# Altium project shield.PrjPcb
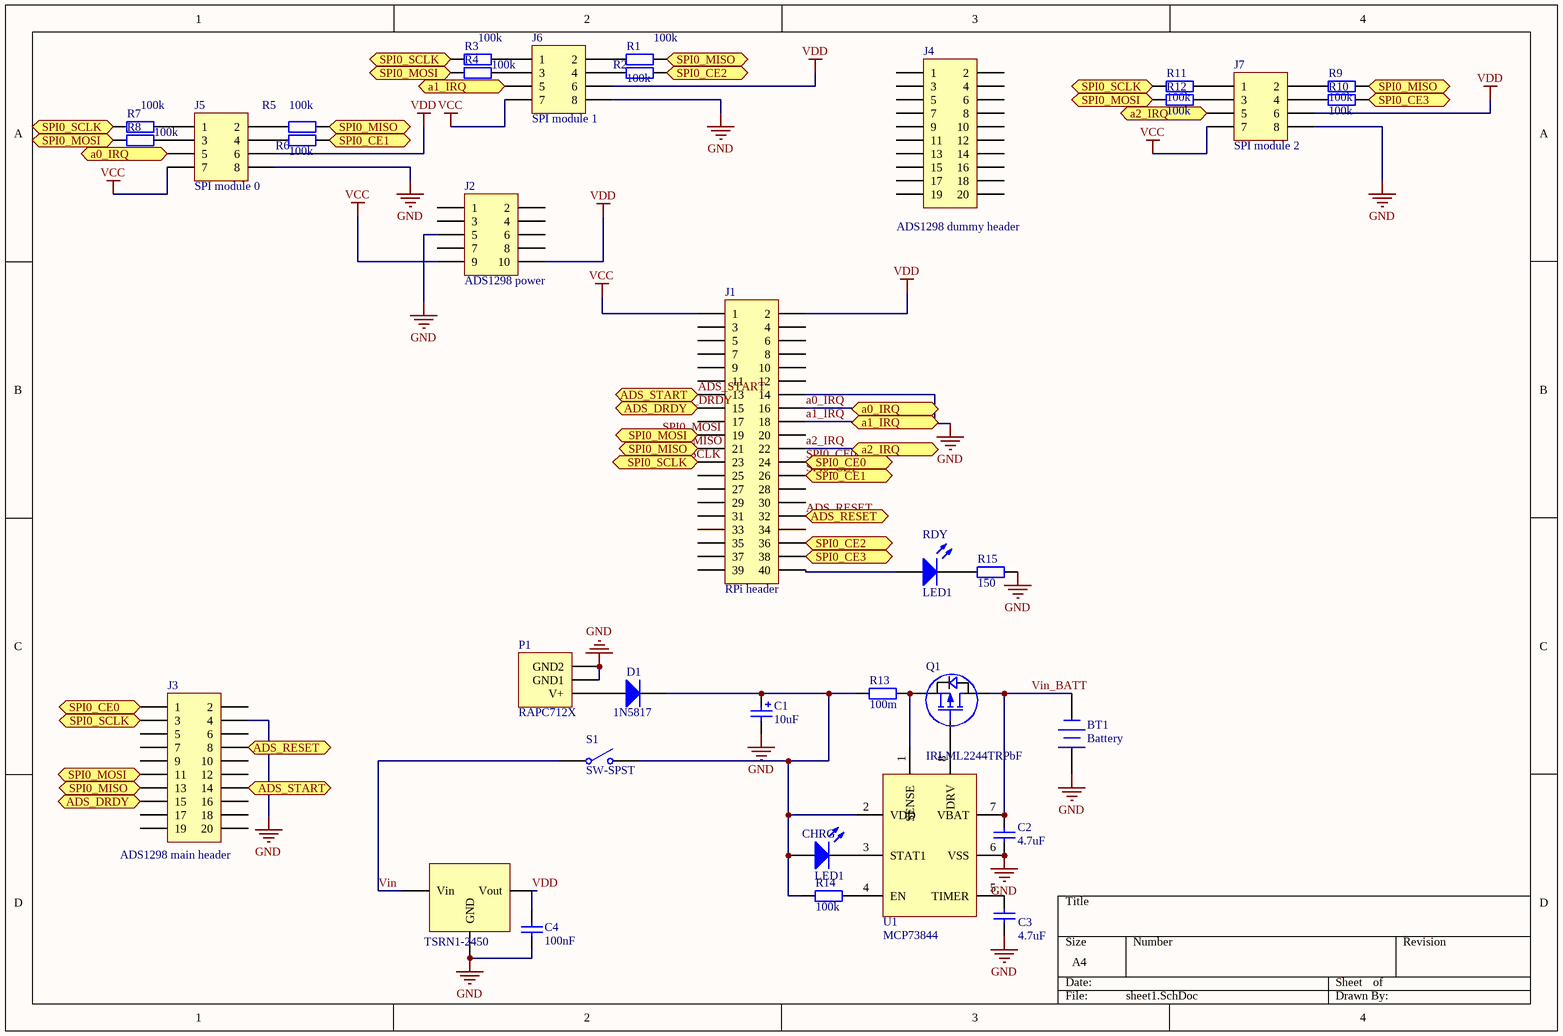
[diagram p0: sheet1.SchDoc]
1 sheet, 35 parts. Net scope: global (net labels, ports and power ports of the same name join across sheets).
Board file: shield.PcbDoc

## Sheet sheet1.SchDoc
size A4; SheetNumber: 1

### Parts
BT1  Battery  [HDR1X2H]
C1  value 10uF  [CAPR5-4X5]  (hidden comment: Comment)
C2  value 4.7uF  [CAPR5-4X5]  (hidden comment: Comment)
C3  value 4.7uF  [CAPR5-4X5]  (hidden comment: Comment)
C4  value 100nF  [CAPR5-4X5]  (hidden comment: Comment)
CHRG  LED1  [LED-1]
D1  1N5817  [DO-41]
J1  RPi header  [HDR2X20]
J2  ADS1298 power  [HDR2X5]
J3  ADS1298 main header  [HDR2X10]
J4  ADS1298 dummy header  [HDR2X10]
J5  SPI module 0  [HDR1X8H]
J6  SPI module 1  [HDR1X8H]
J7  SPI module 2  [HDR1X8H]
P1  RAPC712X  [DCjack]
Q1  IRLML2244TRPbF  [SOT-23_L]
R1  value 100k  [AXIAL-0.6]  (hidden comment: Comment)
R2  value 100k  [AXIAL-0.6]  (hidden comment: Comment)
R3  value 100k  [AXIAL-0.6]  (hidden comment: Comment)
R4  value 100k  [AXIAL-0.6]  (hidden comment: Comment)
R5  value 100k  [AXIAL-0.6]  (hidden comment: Comment)
R6  value 100k  [AXIAL-0.6]  (hidden comment: Comment)
R7  value 100k  [AXIAL-0.6]  (hidden comment: Comment)
R8  value 100k  [AXIAL-0.6]  (hidden comment: Comment)
R9  value 100k  [AXIAL-0.6]  (hidden comment: Comment)
R10  value 100k  [AXIAL-0.6]  (hidden comment: Comment)
R11  value 100k  [AXIAL-0.6]  (hidden comment: Comment)
R12  value 100k  [AXIAL-0.6]  (hidden comment: Comment)
R13  value 100m  [AXIAL-1.0]  (hidden comment: Comment)
R14  value 100k  [AXIAL-0.6]  (hidden comment: Comment)
R15  value 150  [AXIAL-0.6]  (hidden comment: Comment)
RDY  LED1  [LED-1]
RG1  TSRN1-2450  [TSRN1-2450]
S1  SW-SPST  [HDR1X2H]
U1  MCP73844  [MSOP-8]

### Ports
a0_IRQ, a1_IRQ, a2_IRQ, ADS_DRDY, ADS_RESET, ADS_START, SPI0_CE0, SPI0_CE1, SPI0_CE2, SPI0_CE3, SPI0_MISO, SPI0_MISO (in), SPI0_MOSI, SPI0_SCLK

### Nets
GND: BT1.1(+) C1.2 C2.2 C3.2 C4.2 J1.14 J2.5 J3.4 J5.8 J6.8 J7.8 P1.GND1 P1.GND2 R15.1 RG1.2(GND) U1.6(VSS)
VCC: J1.1 J2.9 J5.7 J6.7 J7.7
VDD: C4.1 J1.2 J2.10 J5.6 J6.6 J7.6 RG1.3(Vout)
a0_IRQ: J1.16 J5.5 ; port a0_IRQ
a1_IRQ: J1.18 J6.5 ; port a1_IRQ
a2_IRQ: J1.22 J7.5 ; port a2_IRQ
ADS_RESET: J1.32 J3.8 ; port ADS_RESET
ADS_START: J1.13 J3.14 ; port ADS_START
SPI0_CE0: J1.24 J3.1 ; port SPI0_CE0
SPI0_CE1: J1.26 R6.1 ; port SPI0_CE1
Vin: RG1.1(Vin) S1.1(COMMON)
Vin_BATT: BT1.2(-) C2.1 Q1.3(D) U1.7(VBAT)
NetC1_1: C1.1 CHRG.1(A) D1.2(K) R13.2 R14.2 S1.2(NO) U1.2(VDD)
NetC3_1: C3.1 U1.5(TIMER)
NetCHRG_2: CHRG.2(K) U1.3(STAT1)
NetD1_1: D1.1(A) P1.V+
NetJ1_15: J1.15 J3.15 ; port ADS_DRDY
NetJ1_19: J1.19 J3.11 R4.2 R8.2 R12.2 ; port SPI0_MOSI
NetJ1_21: J1.21 J3.13 R1.1 R5.1 R9.1 ; port SPI0_MISO
NetJ1_23: J1.23 J3.3 R3.2 R7.2 R11.2 ; port SPI0_SCLK
NetJ1_36: J1.36 R2.1 ; port SPI0_CE2
NetJ1_38: J1.38 R10.1 ; port SPI0_CE3
NetJ1_40: J1.40 RDY.1(A)
NetJ5_1: J5.1 R7.1
NetJ5_2: J5.2 R5.2
NetJ5_3: J5.3 R8.1
NetJ5_4: J5.4 R6.2
NetJ6_1: J6.1 R3.1
NetJ6_2: J6.2 R1.2
NetJ6_3: J6.3 R4.1
NetJ6_4: J6.4 R2.2
NetJ7_1: J7.1 R11.1
NetJ7_2: J7.2 R9.2
NetJ7_3: J7.3 R12.1
NetJ7_4: J7.4 R10.2
NetQ1_1: Q1.1(G) U1.8(DRV)
NetQ1_2: Q1.2(S) R13.1 U1.1(SENSE)
NetR14_1: R14.1 U1.4(EN)
NetR15_2: R15.2 RDY.2(K)

Not connected (* = marked no-connect by the designer): J1 3 4 5 6 7 8 9 10 11 12 17 20 25 27 28 29 30 31 33 34 35 37 39; J2 1 2 3 4 6 7 8; J3 2 5 6 7 9 10 12 16 17 18 19 20; J4 1 2 3 4 5 6 7 8 9 10 11 12 13 14 15 16 17 18 19 20

### Notes on the sheet
- Labels drawn without touching a wire or pin: ADS_DRDY, SPI0_MISO, SPI0_MOSI, SPI0_SCLK

### Library data of the parts
BT1 = Battery: Multicell Battery; Published: 24-Mar-1999; LatestRevisionDate: 17-Jul-2002; LatestRevisionNote: Re-released for DXP Platform.; PackageReference: BAT-2; Publisher: Altium Limited; PackageDescription: Battery; 2 Leads
C1 = Cap Pol1: Polarized Capacitor (Radial); Published: 8-Jun-2000; LatestRevisionDate: 17-Jul-2002; LatestRevisionNote: Re-released for DXP Platform.; PackageReference: RB7.6-15; Publisher: Altium Limited; PackageDescription: Polarized Capacitor (Radial); 2 Leads
C2-C4 = Cap: Capacitor; Published: 8-Jun-2000; LatestRevisionDate: 17-Jul-2002; LatestRevisionNote: Re-released for DXP Platform.; PackageReference: RAD-0.3; Publisher: Altium Limited; PackageDescription: Radial Cap, Thru-Hole; 2 Leads; 0.3 in Pin Spacing
CHRG RDY = LED1: Typical RED GaAs LED; Published: 8-Jun-2000; LatestRevisionDate: 08-Jul-2005; LatestRevisionNote: Mech Layer 1 removed.; PackageReference: LED-1; Publisher: Altium Limited; PackageDescription: LED; 2 Leads
D1 = Diode 1N4001: 1 Amp General Purpose Rectifier; Published: 8-Jun-2000; LatestRevisionDate: 17-Jul-2002; LatestRevisionNote: Re-released for DXP Platform.; DatasheetVersion: 1998; PackageVersion: Aug-1999; PackageReference: DO-41; Publisher: Altium Limited; PackageDescription: Diode, Axial; Body 5.2 x 2.7 mm (LxDia. max), Lead Dia. 0.86 mm (max); Code_JEDEC: DO-204-AL; ComponentLink1Description: Manufacturer Link; ComponentLink1URL: http://www.fairchildsemi.com/; ComponentLink2Description: Datasheet; ComponentLink2URL: http://www.fairchildsemi.com/ds/1N%2F1N4001.pdf
J1 = Header 20X2: Header, 20-Pin, Dual row; LatestRevisionDate: 17-Jul-2002; LatestRevisionNote: Re-released for DXP Platform.; Publisher: Altium Limited
J2 = Header 5X2: Header, 5-Pin, Dual row; LatestRevisionDate: 17-Jul-2002; LatestRevisionNote: Re-released for DXP Platform.; Publisher: Altium Limited
J3 J4 = Header 10X2: Header, 10-Pin, Dual row; LatestRevisionDate: 17-Jul-2002; LatestRevisionNote: Re-released for DXP Platform.; Publisher: Altium Limited
J5-J7 = Header 4X2: Header, 4-Pin, Dual row; LatestRevisionDate: 17-Jul-2002; LatestRevisionNote: Re-released for DXP Platform.; Publisher: Altium Limited
P1 = DCjack: Header, 3-Pin; LatestRevisionDate: 17-Jul-2002; LatestRevisionNote: Re-released for DXP Platform.; Publisher: Altium Limited
Q1 = IRLML2244TRPbF: power MOSFET p; Published: 8-Jun-2000; LatestRevisionDate: 17-Jul-2002; LatestRevisionNote: Re-released for DXP Platform.; PackageVersion: 1995/1996; PackageReference: E3; Publisher: Altium Limited; PackageDescription: TO, Flat Index; 3 In-Line, Axial Leads; Body Dia. 4.6mm; Lead Dia. 0.5 mm (max)
R1-R12 R14 R15 = Res2: Resistor; Published: 8-Jun-2000; LatestRevisionDate: 17-Jul-2002; LatestRevisionNote: Re-released for DXP Platform.; PackageReference: AXIAL-0.4; Publisher: Altium Limited; PackageDescription: Axial Device, Thru-Hole; 2 Leads; 0.4 in Pin Spacing
R13 = Rsense: Resistor; Published: 8-Jun-2000; LatestRevisionDate: 17-Jul-2002; LatestRevisionNote: Re-released for DXP Platform.; PackageReference: AXIAL-0.4; Publisher: Altium Limited; PackageDescription: Axial Device, Thru-Hole; 2 Leads; 0.4 in Pin Spacing
S1 = SW-SPST: Single-Pole, Single-Throw Switch; Published: 24-Mar-1999; LatestRevisionDate: 17-Jul-2002; LatestRevisionNote: Re-released for DXP Platform.; PackageReference: SPST-2; Publisher: Altium Limited; PackageDescription: Switch; 2 Leads
U1 = MCP7384x: Header, 4-Pin, Dual row; LatestRevisionDate: 17-Jul-2002; LatestRevisionNote: Re-released for DXP Platform.; Publisher: Altium Limited